# EAGLE design PIC12F1822 (EAGLE 8.2.2)

## Sheet 1 of 2: power / conn
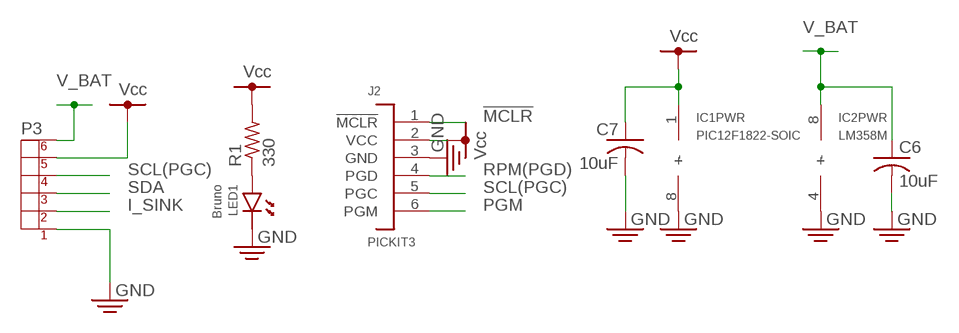
[diagram p0: schematic, sheet 1]

### Parts
C6  10uF  C-USC0805  [C0805]
C7  10uF  C-USC0805  [C0805]
IC1  PIC12F1822-SOIC  [8-SOP]
IC2  LM358M  [8-SOP]
J2  PICKIT3  [PICKIT3]
LED1  Bruno  LED3MM  [LED3MM]
P3  CONN-6P-PNI  [B06B-PNISK]
R1  330  R-US_R0805  [R0805]

### Nets
!MCLR: J2.1(!MCLR) ; also sheet 2
GND [GND]: C6.2 C7.2 IC1.8(PWR:-) IC2.4(PWR:-) J2.3(GND) LED1.C P3.1 ; also sheet 2
I_SINK: P3.2 ; also sheet 2
N$2: LED1.A R1.1
PGM: J2.6(PGM)
RPM(PGD): J2.4(PGD) ; also sheet 2
SCL(PGC): J2.5(PGC) P3.4 ; also sheet 2
SDA: P3.3 ; also sheet 2
V_BAT [2A]: C6.1 IC2.8(PWR:+) P3.6 ; also sheet 2
VCC: C7.1 IC1.1(PWR:+) J2.2(VCC) P3.5 R1.2 ; also sheet 2

## Sheet 2 of 2: cct
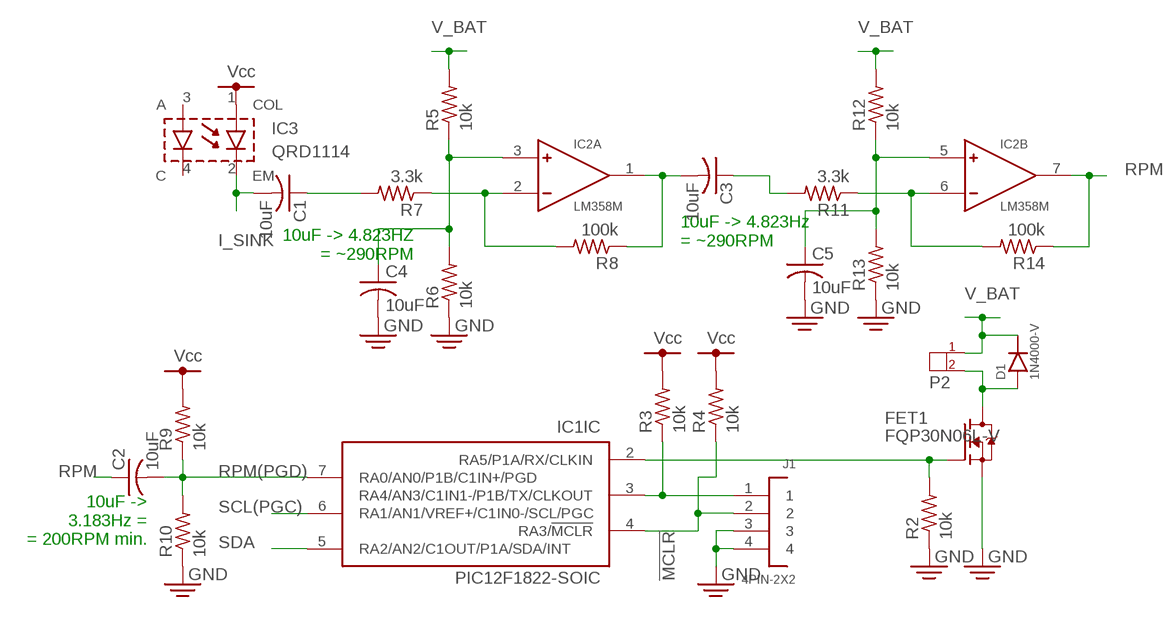
[diagram p1: schematic, sheet 2]

### Parts
C1  10uF  C-USC0805  [C0805]
C2  10uF  C-USC0805  [C0805]
C3  10uF  C-USC0805  [C0805]
C4  10uF  C-USC0805  [C0805]
C5  10uF  C-USC0805  [C0805]
D1  1N4000-V  [DIODE-V]
FET1  FQP30N06L-V  [TO220V]
IC3  QRD1114  [QRD1114]
J1  4PIN-2X2  [4P-2X2]
P2  CONN-2P-PNI  [B02B-PNISK]
R2  10k  R-US_R0805  [R0805]
R3  10k  R-US_R0805  [R0805]
R4  10k  R-US_R0805  [R0805]
R5  10k  R-US_R0805  [R0805]
R6  10k  R-US_R0805  [R0805]
R7  3.3k  R-US_R0805  [R0805]
R8  100k  R-US_R0805  [R0805]
R9  10k  R-US_R0805  [R0805]
R10  10k  R-US_R0805  [R0805]
R11  3.3k  R-US_R0805  [R0805]
R12  10k  R-US_R0805  [R0805]
R13  10k  R-US_R0805  [R0805]
R14  100k  R-US_R0805  [R0805]

### Nets
!MCLR: IC1.4(IC:RA3/!MCLR) J1.2 R4.1 ; also sheet 1
GND [GND]: C4.2 C5.2 FET1.3(S) J1.3 J1.4 R2.1 R6.1 R10.1 R13.1 ; also sheet 1
I_SINK: C1.2 IC3.2(EM) ; also sheet 1
N$1: FET1.1(G) IC1.2(IC:RA5/P1A/RX/CLKIN) R2.2
N$3 [2A]: D1.A FET1.2(D) P2.2
N$5: IC1.3(IC:RA4/AN3/C1IN1-/P1B/TX/CLKOUT) J1.1 R3.1
N$6: C4.1 IC2.3(A:+) R5.1 R6.2
N$7: IC2.2(A:-) R7.1 R8.2
N$8: C1.1 R7.2
N$10: C3.2 IC2.1(A:OUT) R8.1
N$11: C3.1 R11.2
N$12: C5.1 IC2.5(B:+) R12.1 R13.2
N$13: IC2.6(B:-) R11.1 R14.2
RPM: C2.1 IC2.7(B:OUT) R14.1
RPM(PGD): C2.2 IC1.7(IC:RA0/AN0/P1B/C1IN+/PGD) R9.1 R10.2 ; also sheet 1
SCL(PGC): IC1.6(IC:RA1/AN1/VREF+/C1IN0-/SCL/PGC) ; also sheet 1
SDA: IC1.5(IC:RA2/AN2/C1OUT/P1A/SDA/INT) ; also sheet 1
V_BAT [2A]: D1.C P2.1 R5.2 R12.2 ; also sheet 1
VCC: IC3.1(COL) R3.2 R4.2 R9.2 ; also sheet 1
Unconnected: IC3.3(A) IC3.4(C)

### Notes on the sheet
- 10uF -> 4.823HZ
  = ~290RPM
- 10uF -> 4.823Hz
  = ~290RPM
- 10uF ->
  3.183Hz =
  = 200RPM min.

## Library data of the parts
C1-C7 = rcl:C-US: CAPACITOR, American symbol
D1 = Aaron:1N4000
FET1 = Aaron:FQP30N06L
IC1 = Aaron SMT:PIC12F1822
IC2 = Aaron SMT:LM358
IC3 = Aaron:QRD1114
J1 = Aaron Header:4PIN
J2 = Aaron:PICKIT3
LED1 = Aaron:LED
P2 = Aaron:CONN-2P
P3 = Aaron:CONN-6P
R1-R14 = rcl:R-US_: RESISTOR, American symbol

## Net classes
0 default: width 0.305 mm, drill 0.762 mm, clearance 0.381 mm
1 GND: width 0.635 mm, drill 0.762 mm, clearance 0.381 mm
2 2A: width 0.889 mm, drill 0.762 mm, clearance 0.381 mm

## Board
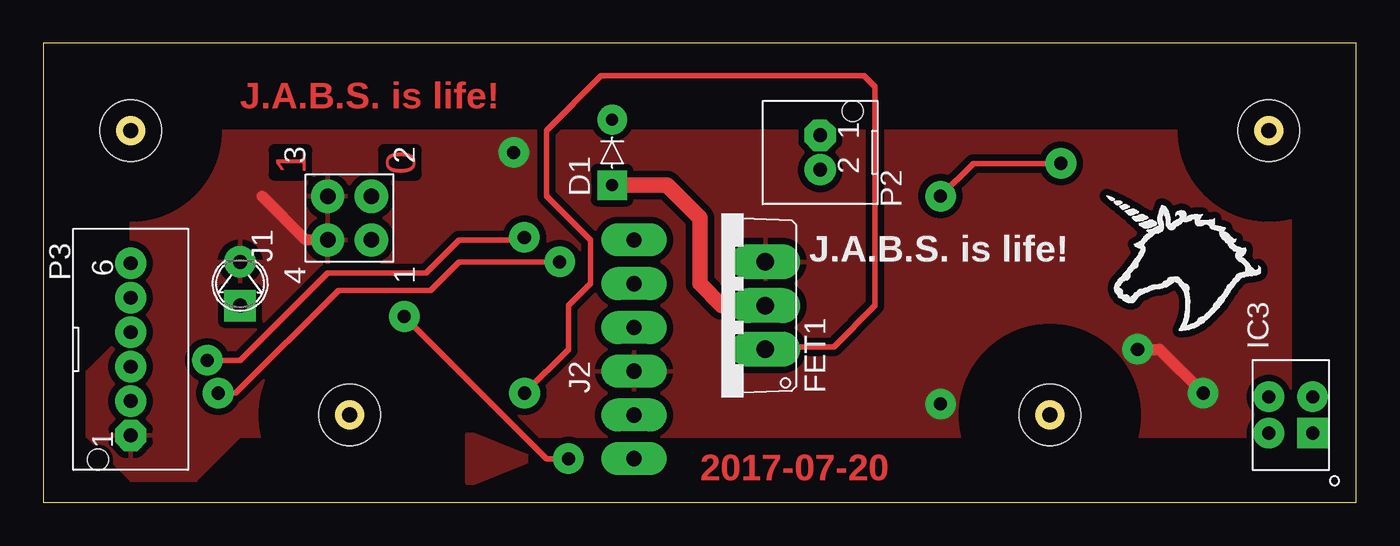
[diagram p2: board, top side]
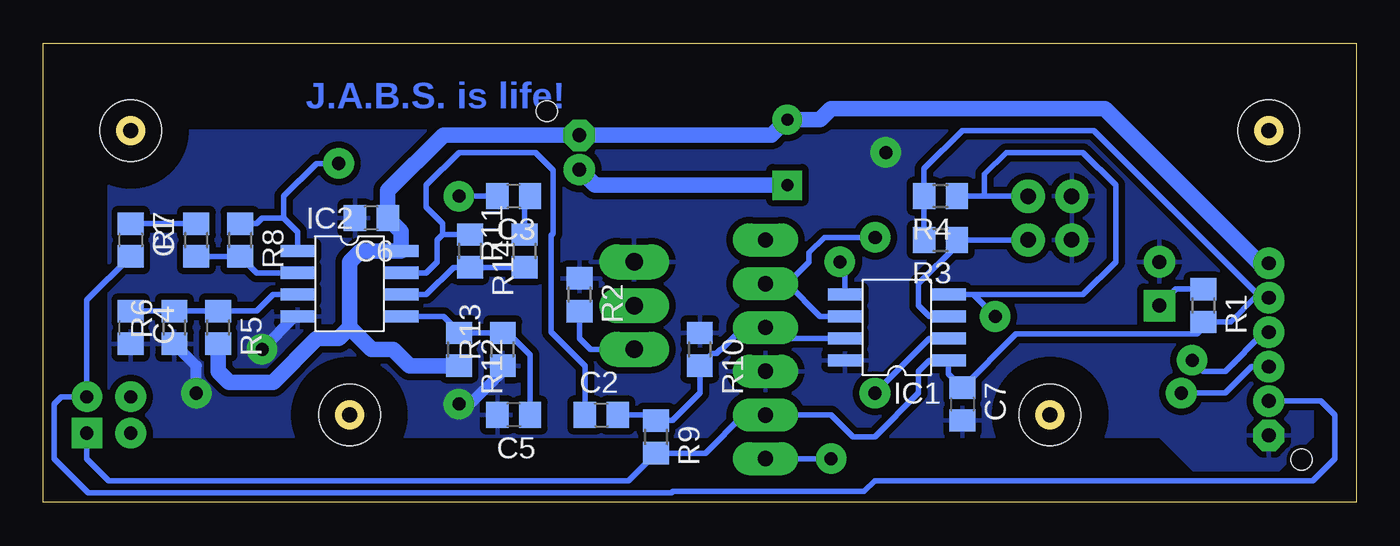
[diagram p3: board, bottom side, seen from below]

Size 76.2 x 26.67 mm. Coordinates in mm from the lower left corner, seen from the top.
Outline: 0,0 76.2,0 76.2,26.67 0,26.67 0,0
Copper layers (1*16): Top 0.035mm / dielectric 1.5mm / Bottom 0.035mm
Design rules "Aaron's UV exposure box": minimum track width 10mil, minimum drill 25mil, track to track 9mil, track to pad 9mil, pad to pad 9mil, via to via 9mil, smd to smd 9mil, copper to edge 10mil, drill to drill 20mil, minimum pad ring 20mil, minimum via ring 20mil, stop-mask expansion 5mil, vias tented up to drill 0mil, thermal gap 15mil

### Footprints (pad centres in the part's own frame; a part is rotated, then mirrored left to right if it is on the bottom)
C0805 = smd 1.3 x 1.5: 1 -0.95,0; 2 0.95,0
DIODE-V = drill 0.7 pad 1.676 square: A -1.905,0 | drill 0.7 pad 1.676: C 1.905,0
TO220V = drill 1.016 long: 1 -2.54,-2.54; 2 0,-2.54; 3 2.54,-2.54
8-SOP = smd 2 x 0.7: 1 -3,1.905; 2 -3,0.635; 3 -3,-0.635; 4 -3,-1.905; 5 3,-1.905; 6 3,-0.635; 7 3,0.635; 8 3,1.905
QRD1114 = drill 0.762 pad 1.676 square: 1 -1.054,-1.27 | drill 0.762 pad 1.676: 2 1.054,-1.27; 3 1.054,1.27; 4 -1.054,1.27
4P-2X2 = drill 0.9 pad 1.93: 1 -1.27,-1.27; 2 1.27,-1.27; 3 1.27,1.27; 4 -1.27,1.27
PICKIT3 = drill 0.889 pad 1.422 long: 1 -6.35,0; 2 -3.81,0; 3 -1.27,0; 4 1.27,0; 5 3.81,0; 6 6.35,0
LED3MM = drill 0.813 pad 1.5 square: A -1.27,0 | drill 0.813 pad 1.5: C 1.27,0
B02B-PNISK = drill 0.8 pad 1.714 octagon: 1 1,0 | drill 0.8 pad 1.714: 2 -1,0 | hole 1.2: 2.4,-1.9
B06B-PNISK = drill 0.8 pad 1.714 octagon: 1 5,0 | drill 0.8 pad 1.714: 2 3,0; 3 1,0; 4 -1,0; 5 -3,0; 6 -5,0 | hole 1.2: 6.4,-1.9
R0805 = smd 1.3 x 1.5: 1 -0.95,0; 2 0.95,0
#6-32 = hole 3.556: 0,0

### Placement (x,y rotation side)
C1  71.12,15.24 270 bottom
C2  43.81,5.08 0 bottom
C3  48.9,17.78 180 bottom
C4  71.12,10.16 270 bottom
C5  48.9,5.08 180 bottom
C6  57.15,16.51 180 bottom
C7  22.86,5.71 270 bottom
D1  33.02,20.32 90 top
FET1  39.37,11.43 90 top
IC1  26.67,10.16 180 bottom
IC2  58.42,12.7 0 bottom
IC3  72.39,5.08 90 top
J1  17.78,16.51 90 top
J2  34.29,8.89 90 top
LED1  11.43,12.7 90 top
P2  45.09,20.32 90 top
P3  5.08,8.89 270 top
R1  8.89,11.43 270 bottom
R2  45.09,12.06 270 bottom
R3  24.13,15.24 180 bottom
R4  24.13,17.78 180 bottom
R5  66.04,10.16 270 bottom
R6  68.58,10.16 90 bottom
R7  67.31,15.24 90 bottom
R8  64.77,15.24 270 bottom
R9  40.64,3.81 270 bottom
R10  38.1,8.89 270 bottom
R11  48.26,14.61 90 bottom
R12  52.07,8.89 270 bottom
R13  49.53,8.89 90 bottom
R14  51.44,14.61 270 bottom
U$16  [#6-32]  5.08,21.59 0 top
U$17  [#6-32]  58.42,5.08 0 top
U$18  [#6-32]  71.12,21.59 0 top
U$19  [#6-32]  17.78,5.08 0 top
U$20  [UNICORN-TOP]  66.04,13.97 0 top
U$21  [UNICORN-SCREEN]  66.04,13.97 0 top

### Tracks (layer width: path | path; a pad name or v marks a point on that pad's centre or on a via)
!MCLR  (via drill 0.76)
  Top 0.305: v30.48,2.54 29.21,2.54 v20.95,10.79
  Bottom 0.305: R4.1 21.59,17.78 | 22.23,12.06 15.88,12.06 13.97,13.97 13.97,18.41 15.88,20.32 20.32,20.32 21.59,19.05 21.59,17.78 | J2.1 v30.48,2.54 | IC1.4 22.23,12.06 | 22.23,12.06 v20.95,10.79 | 21.59,17.78 J1.2
GND  (via drill 0.76)
  Top 0.635: v63.5,8.89 64.77,8.89 v67.31,6.35 | J1.4 15.24,15.24 12.7,17.78
  Bottom 0.635: IC2.4 61.59,10.79 v63.5,8.89 | v67.31,6.35 67.31,7.94 R6.1 | R13.1 49.53,7.62 51.44,5.71 v52.07,5.71
  other vias: 27.3,20.32
  pour Bottom: 5.08,21.59 5.08,10.16 2.54,7.62 2.54,3.81 5.08,1.27 8.89,1.27 11.43,3.81 72.39,3.81 72.39,21.59
  pour Top: 5.08,21.59 5.08,10.16 2.54,7.62 2.54,3.81 5.08,1.27 8.89,1.27 11.43,3.81 72.39,3.81 72.39,21.59
I_SINK
  Bottom 0.305: P3.2 2.08,5.89 1.27,5.08 1.27,2.54 2.54,1.27 27.94,1.27 28.57,0.64 39.66,0.64 39.73,0.56 41.55,0.56 73.58,0.56 75.56,2.54 75.56,5.71 75.15,6.13 IC3.2 73.66,11.75 C1.2
N$1  (via drill 0.76)
  Top 0.305: v27.94,6.35 30.48,8.89 30.48,11.43 31.75,12.7 31.75,15.24 29.21,17.78 29.21,21.59 32.38,24.77 47.62,24.77 48.26,24.13 48.26,11.43 45.87,9.04 42.59,9.04 42.44,8.89 FET1.1
  Bottom 0.305: IC1.2 24.77,9.53 v27.94,6.35 | R2.2 45.09,9.53 44.45,8.89 FET1.1
N$2
  Bottom 0.305: R1.1 10.48,12.38 LED1.A
N$3
  Top 0.889: D1.A 36.2,18.41 38.1,16.51 38.1,12.7 39.37,11.43 FET1.2
  Bottom 0.889: D1.A 44.18,18.41 P2.2
N$4
  pour Top: 27.94,2.54 24.77,3.81 24.77,1.27
N$5
  Bottom 0.305: IC1.3 24.77,10.79 25.4,11.43 25.4,12.7 23.18,14.92 R3.1 J1.1
N$6
  Bottom 0.305: IC2.3 62.87,12.06 63.82,11.11 R5.1 R6.2 C4.1
N$7
  Bottom 0.305: R7.1 R8.2 63.81,13.34 IC2.2
N$8
  Bottom 0.305: C1.1 R7.2
N$10  (via drill 0.76)
  Top 0.305: v59.05,19.68 53.98,19.68 v52.07,17.78
  Bottom 0.305: IC2.1 61.42,15.7 62.23,16.51 | R8.1 63.82,16.19 63.5,16.51 62.23,16.51 | C3.2 v52.07,17.78 | 62.23,16.51 62.23,17.78 60.33,19.68 v59.05,19.68
N$11
  Bottom 0.305: R11.2 48.26,17.46 C3.1
N$12
  Bottom 0.305: 52.01,9.84 R13.2 49.21,9.84 47.95,8.57 C5.1 | 52.01,9.84 R12.1 | IC2.5 52.97,10.79 52.01,9.84
N$13
  Bottom 0.305: IC2.6 53.98,12.06 52.38,13.65 R14.2 R11.1
RPM
  Bottom 0.305: IC2.7 53.98,13.34 53.34,13.97 53.34,15.24 53.02,15.55 | R14.1 53.02,15.55 | C2.1 44.77,7.93 46.74,9.91 46.74,15.49 46.61,15.62 46.61,19.3 47.62,20.32 52.07,20.32 53.98,18.41 53.98,17.14 53.02,16.2 53.02,15.55
RPM(PGD)
  Bottom 0.305: IC1.7 33.66,9.53 J2.4 35.56,10.16 36.83,8.89 36.9,8.89 37.13,8.66 37.38,8.66 R10.2 38.1,6.35 39.69,4.76 R9.1 40.96,5.08 C2.2
SCL(PGC)  (via drill 0.76)
  Top 0.305: v9.53,8.26 11.43,8.26 16.51,13.34 22.23,13.34 24.13,15.24 28.19,15.24 v27.92,15.39
  Bottom 0.305: P3.4 5.35,9.89 7.62,7.62 8.89,7.62 v9.53,8.26 | v27.92,15.39 30.86,15.39 31.75,14.5 31.75,13.97 33.02,12.7 | IC1.6 31.11,10.79 33.02,12.7 | J2.5 33.02,12.7
SDA  (via drill 0.76)
  Top 0.305: v10.16,6.35 11.18,6.35 17.14,12.32 22.48,12.32 24.13,13.97 v29.97,13.97
  Bottom 0.305: P3.3 6.08,7.89 7.62,6.35 v10.16,6.35 | IC1.5 29.67,13.16 v29.97,13.97
V_BAT
  Bottom 0.889: P3.6 5.63,13.89 14.61,22.86 30.48,22.86 31.11,22.23 D1.C 33.92,21.32 P2.1 52.98,21.32 56.2,18.09 C6.1 55.42,15.73 IC2.8 57.78,14.61 58.42,13.97 58.42,10.16 | R5.2 66.04,7.62 65.41,6.99 62.87,6.99 60.33,9.53 59.05,9.53 58.42,10.16 | R12.2 54.93,7.94 55.88,8.89 57.15,8.89 58.42,10.16
VCC
  Bottom 0.305: P3.5 5.54,11.89 | 5.54,11.89 15.24,21.59 22.86,21.59 25.08,19.37 R4.2 R3.2 | 5.54,11.89 5.89,11.89 7.3,10.48 R1.2 8.89,10.16 9.27,9.78 19.75,9.78 C7.1 23.67,7.47 IC1.1 24.77,8.26 25.4,7.62 25.4,6.35 27.94,3.81 29.21,3.81 30.48,5.08 J2.2 35.56,5.08 37.78,2.86 R9.2 42.23,1.27 72.39,1.27 73.66,2.54 IC3.1

### Text on the board
Top: J.A.B.S. is life! | 1 | 0 | 2017-07-20
Bottom: J.A.B.S. is life!
tPlace: J.A.B.S. is life!